# Altium project slam.PrjPCB
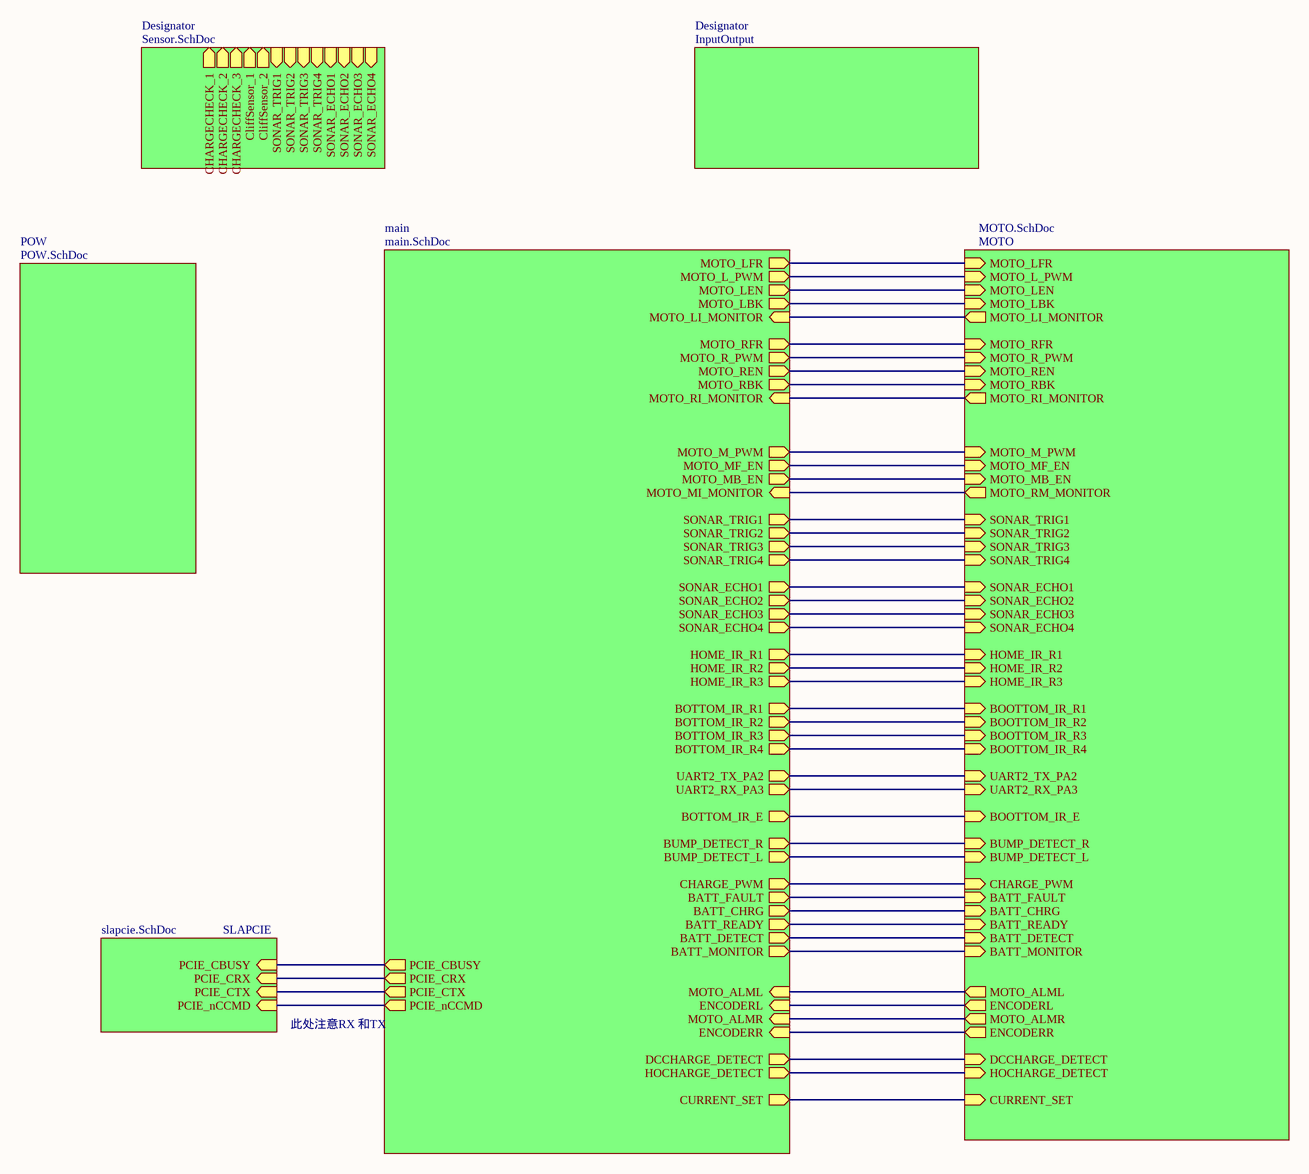
[diagram p0: 框图.SchDoc]
5 sheets, 113 parts. Net scope: hierarchical (ports join the sheet entries above them; power ports are global).
Board file: MAIN.PcbDoc
Sheets:
  框图.SchDoc
    main = main.SchDoc
    SLAPCIE = slapcie.SchDoc
    Designator = Sensor.SchDoc
    Designator = InputOutput.SchDoc

## Sheet 框图.SchDoc
size A3

### Sub-sheets
Designator = Sensor.SchDoc: CHARGECHECK_1 (out), CHARGECHECK_2 (out), CHARGECHECK_3 (out), CliffSensor_1 (out), CliffSensor_2 (out), SONAR_TRIG1 (in), SONAR_TRIG2 (in), SONAR_TRIG3 (in), SONAR_TRIG4 (in), SONAR_ECHO1 (in), SONAR_ECHO2 (in), SONAR_ECHO3 (in), SONAR_ECHO4 (in)
Designator = InputOutput: no entries
main = main.SchDoc: CHARGE_PWM (out), UART2_TX_PA2 (out), UART2_RX_PA3 (out), BOTTOM_IR_R4 (out), BATT_DETECT (out), PCIE_CBUSY (out), BUMP_DETECT_L (out), HOCHARGE_DETECT (out), DCCHARGE_DETECT (out), BUMP_DETECT_R (out), CURRENT_SET (out), BOTTOM_IR_R2 (out), BOTTOM_IR_R1 (out), BATT_MONITOR (out), BOTTOM_IR_R3 (out), MOTO_RI_MONITOR (in), BOTTOM_IR_E (out), PCIE_nCCMD (out), MOTO_MB_EN (out), MOTO_M_PWM (out), MOTO_MF_EN (out), MOTO_LEN (out), MOTO_REN (out), MOTO_RBK (out), MOTO_LBK (out), HOME_IR_R1 (out), HOME_IR_R2 (out), HOME_IR_R3 (out), BATT_READY (out), BATT_CHRG (out), BATT_FAULT (out), SONAR_ECHO1 (out), SONAR_ECHO2 (out), SONAR_ECHO3 (out), SONAR_ECHO4 (out), SONAR_TRIG1 (out), SONAR_TRIG2 (out), SONAR_TRIG3 (out), MOTO_R_PWM (out), MOTO_L_PWM (out), SONAR_TRIG4 (out), PCIE_CRX (out), PCIE_CTX (out), MOTO_MI_MONITOR (in), MOTO_LI_MONITOR (in), MOTO_ALML (in), ENCODERL (in), MOTO_ALMR (in), ENCODERR (in), MOTO_LFR (out), MOTO_RFR (out)
MOTO = MOTO.SchDoc (file not in this document): MOTO_L_PWM (in), MOTO_LEN (in), MOTO_LBK (in), MOTO_R_PWM (in), MOTO_REN (in), MOTO_RBK (in), MOTO_MF_EN (in), MOTO_MB_EN (in), MOTO_LI_MONITOR (out), MOTO_RI_MONITOR (out), MOTO_RM_MONITOR (out), MOTO_ALML (out), ENCODERL (out), MOTO_ALMR (out), ENCODERR (out), SONAR_TRIG1 (in), SONAR_TRIG2 (in), SONAR_TRIG3 (in), SONAR_TRIG4 (in), SONAR_ECHO1 (in), SONAR_ECHO2 (in), SONAR_ECHO3 (in), SONAR_ECHO4 (in), HOME_IR_R1 (in), HOME_IR_R2 (in), HOME_IR_R3 (in), BOOTTOM_IR_R1 (in), BOOTTOM_IR_R2 (in), BOOTTOM_IR_R3 (in), BOOTTOM_IR_R4 (in), BOOTTOM_IR_E (in), BUMP_DETECT_R (in), BUMP_DETECT_L (in), UART2_TX_PA2 (in), UART2_RX_PA3 (in), CHARGE_PWM (in), BATT_FAULT (in), BATT_CHRG (in), BATT_READY (in), BATT_DETECT (in), DCCHARGE_DETECT (in), HOCHARGE_DETECT (in), BATT_MONITOR (in), CURRENT_SET (in), MOTO_M_PWM (in), MOTO_LFR (in), MOTO_RFR (in)
POW = POW.SchDoc (file not in this document): no entries
SLAPCIE = slapcie.SchDoc: PCIE_CBUSY (in), PCIE_CRX (in), PCIE_CTX (in), PCIE_nCCMD (in)

### Nets
CBUSY: sheet main/PCIE_CBUSY, sheet SLAPCIE/PCIE_CBUSY
CRX: sheet main/PCIE_CRX, sheet SLAPCIE/PCIE_CRX
CTX: sheet main/PCIE_CTX, sheet SLAPCIE/PCIE_CTX
nCCMD: sheet main/PCIE_nCCMD, sheet SLAPCIE/PCIE_nCCMD
NetU?#2_1: sheet main/BATT_READY, sheet MOTO/BATT_READY
NetU?#2_2: sheet main/BATT_CHRG, sheet MOTO/BATT_CHRG
NetU?#2_3: sheet main/BATT_FAULT, sheet MOTO/BATT_FAULT
NetU?#2_4: sheet main/SONAR_ECHO1, sheet MOTO/SONAR_ECHO1
NetU?#2_15: sheet main/MOTO_MI_MONITOR, sheet MOTO/MOTO_RM_MONITOR
NetU?#2_16: sheet main/BOTTOM_IR_R2, sheet MOTO/BOOTTOM_IR_R2
NetU?#2_17: sheet main/BOTTOM_IR_R1, sheet MOTO/BOOTTOM_IR_R1
NetU?#2_18: sheet main/BATT_MONITOR, sheet MOTO/BATT_MONITOR
NetU?#2_23: sheet main/CHARGE_PWM, sheet MOTO/CHARGE_PWM
NetU?#2_25: sheet main/UART2_TX_PA2, sheet MOTO/UART2_TX_PA2
NetU?#2_26: sheet main/UART2_RX_PA3, sheet MOTO/UART2_RX_PA3
NetU?#2_29: sheet main/BOTTOM_IR_R4, sheet MOTO/BOOTTOM_IR_R4
NetU?#2_31: sheet main/BATT_DETECT, sheet MOTO/BATT_DETECT
NetU?#2_33: sheet main/MOTO_LI_MONITOR, sheet MOTO/MOTO_LI_MONITOR
NetU?#2_34: sheet main/MOTO_RI_MONITOR, sheet MOTO/MOTO_RI_MONITOR
NetU?#2_38: sheet main/SONAR_ECHO2, sheet MOTO/SONAR_ECHO2
NetU?#2_39: sheet main/SONAR_ECHO3, sheet MOTO/SONAR_ECHO3
NetU?#2_40: sheet main/SONAR_ECHO4, sheet MOTO/SONAR_ECHO4
NetU?#2_41: sheet main/SONAR_TRIG1, sheet MOTO/SONAR_TRIG1
NetU?#2_42: sheet main/SONAR_TRIG2, sheet MOTO/SONAR_TRIG2
NetU?#2_43: sheet main/SONAR_TRIG3, sheet MOTO/SONAR_TRIG3
NetU?#2_44: sheet main/MOTO_R_PWM, sheet MOTO/MOTO_R_PWM
NetU?#2_45: sheet main/MOTO_L_PWM, sheet MOTO/MOTO_L_PWM
NetU?#2_46: sheet main/SONAR_TRIG4, sheet MOTO/SONAR_TRIG4
NetU?#2_52: sheet main/BUMP_DETECT_R, sheet MOTO/BUMP_DETECT_R
NetU?#2_54: sheet main/CURRENT_SET, sheet MOTO/CURRENT_SET
NetU?#2_55: sheet main/MOTO_REN, sheet MOTO/MOTO_REN
NetU?#2_56: sheet main/MOTO_LBK, sheet MOTO/MOTO_LBK
NetU?#2_57: sheet main/MOTO_LEN, sheet MOTO/MOTO_LEN
NetU?#2_58: sheet main/BOTTOM_IR_E, sheet MOTO/BOOTTOM_IR_E
NetU?#2_59: sheet main/HOME_IR_R1, sheet MOTO/HOME_IR_R1
NetU?#2_60: sheet main/HOME_IR_R2, sheet MOTO/HOME_IR_R2
NetU?#2_61: sheet main/HOME_IR_R3, sheet MOTO/HOME_IR_R3
NetU?#2_62: sheet main/BOTTOM_IR_R3, sheet MOTO/BOOTTOM_IR_R3
NetU?#2_63: sheet main/MOTO_ALML, sheet MOTO/MOTO_ALML
NetU?#2_64: sheet main/ENCODERL, sheet MOTO/ENCODERL
NetU?#2_65: sheet main/MOTO_ALMR, sheet MOTO/MOTO_ALMR
NetU?#2_66: sheet main/ENCODERR, sheet MOTO/ENCODERR
NetU?#2_82: sheet main/MOTO_MB_EN, sheet MOTO/MOTO_MB_EN
NetU?#2_83: sheet main/MOTO_M_PWM, sheet MOTO/MOTO_M_PWM
NetU?#2_84: sheet main/MOTO_MF_EN, sheet MOTO/MOTO_MF_EN
NetU?#2_85: sheet main/MOTO_LFR, sheet MOTO/MOTO_LFR
NetU?#2_87: sheet main/MOTO_RFR, sheet MOTO/MOTO_RFR
NetU?#2_88: sheet main/MOTO_RBK, sheet MOTO/MOTO_RBK
NetU?#2_91: sheet main/BUMP_DETECT_L, sheet MOTO/BUMP_DETECT_L
NetU?#2_95: sheet main/HOCHARGE_DETECT, sheet MOTO/HOCHARGE_DETECT
NetU?#2_96: sheet main/DCCHARGE_DETECT, sheet MOTO/DCCHARGE_DETECT

### Notes on the sheet
- 此处注意RX 和TX

## Sheet main.SchDoc
size A3
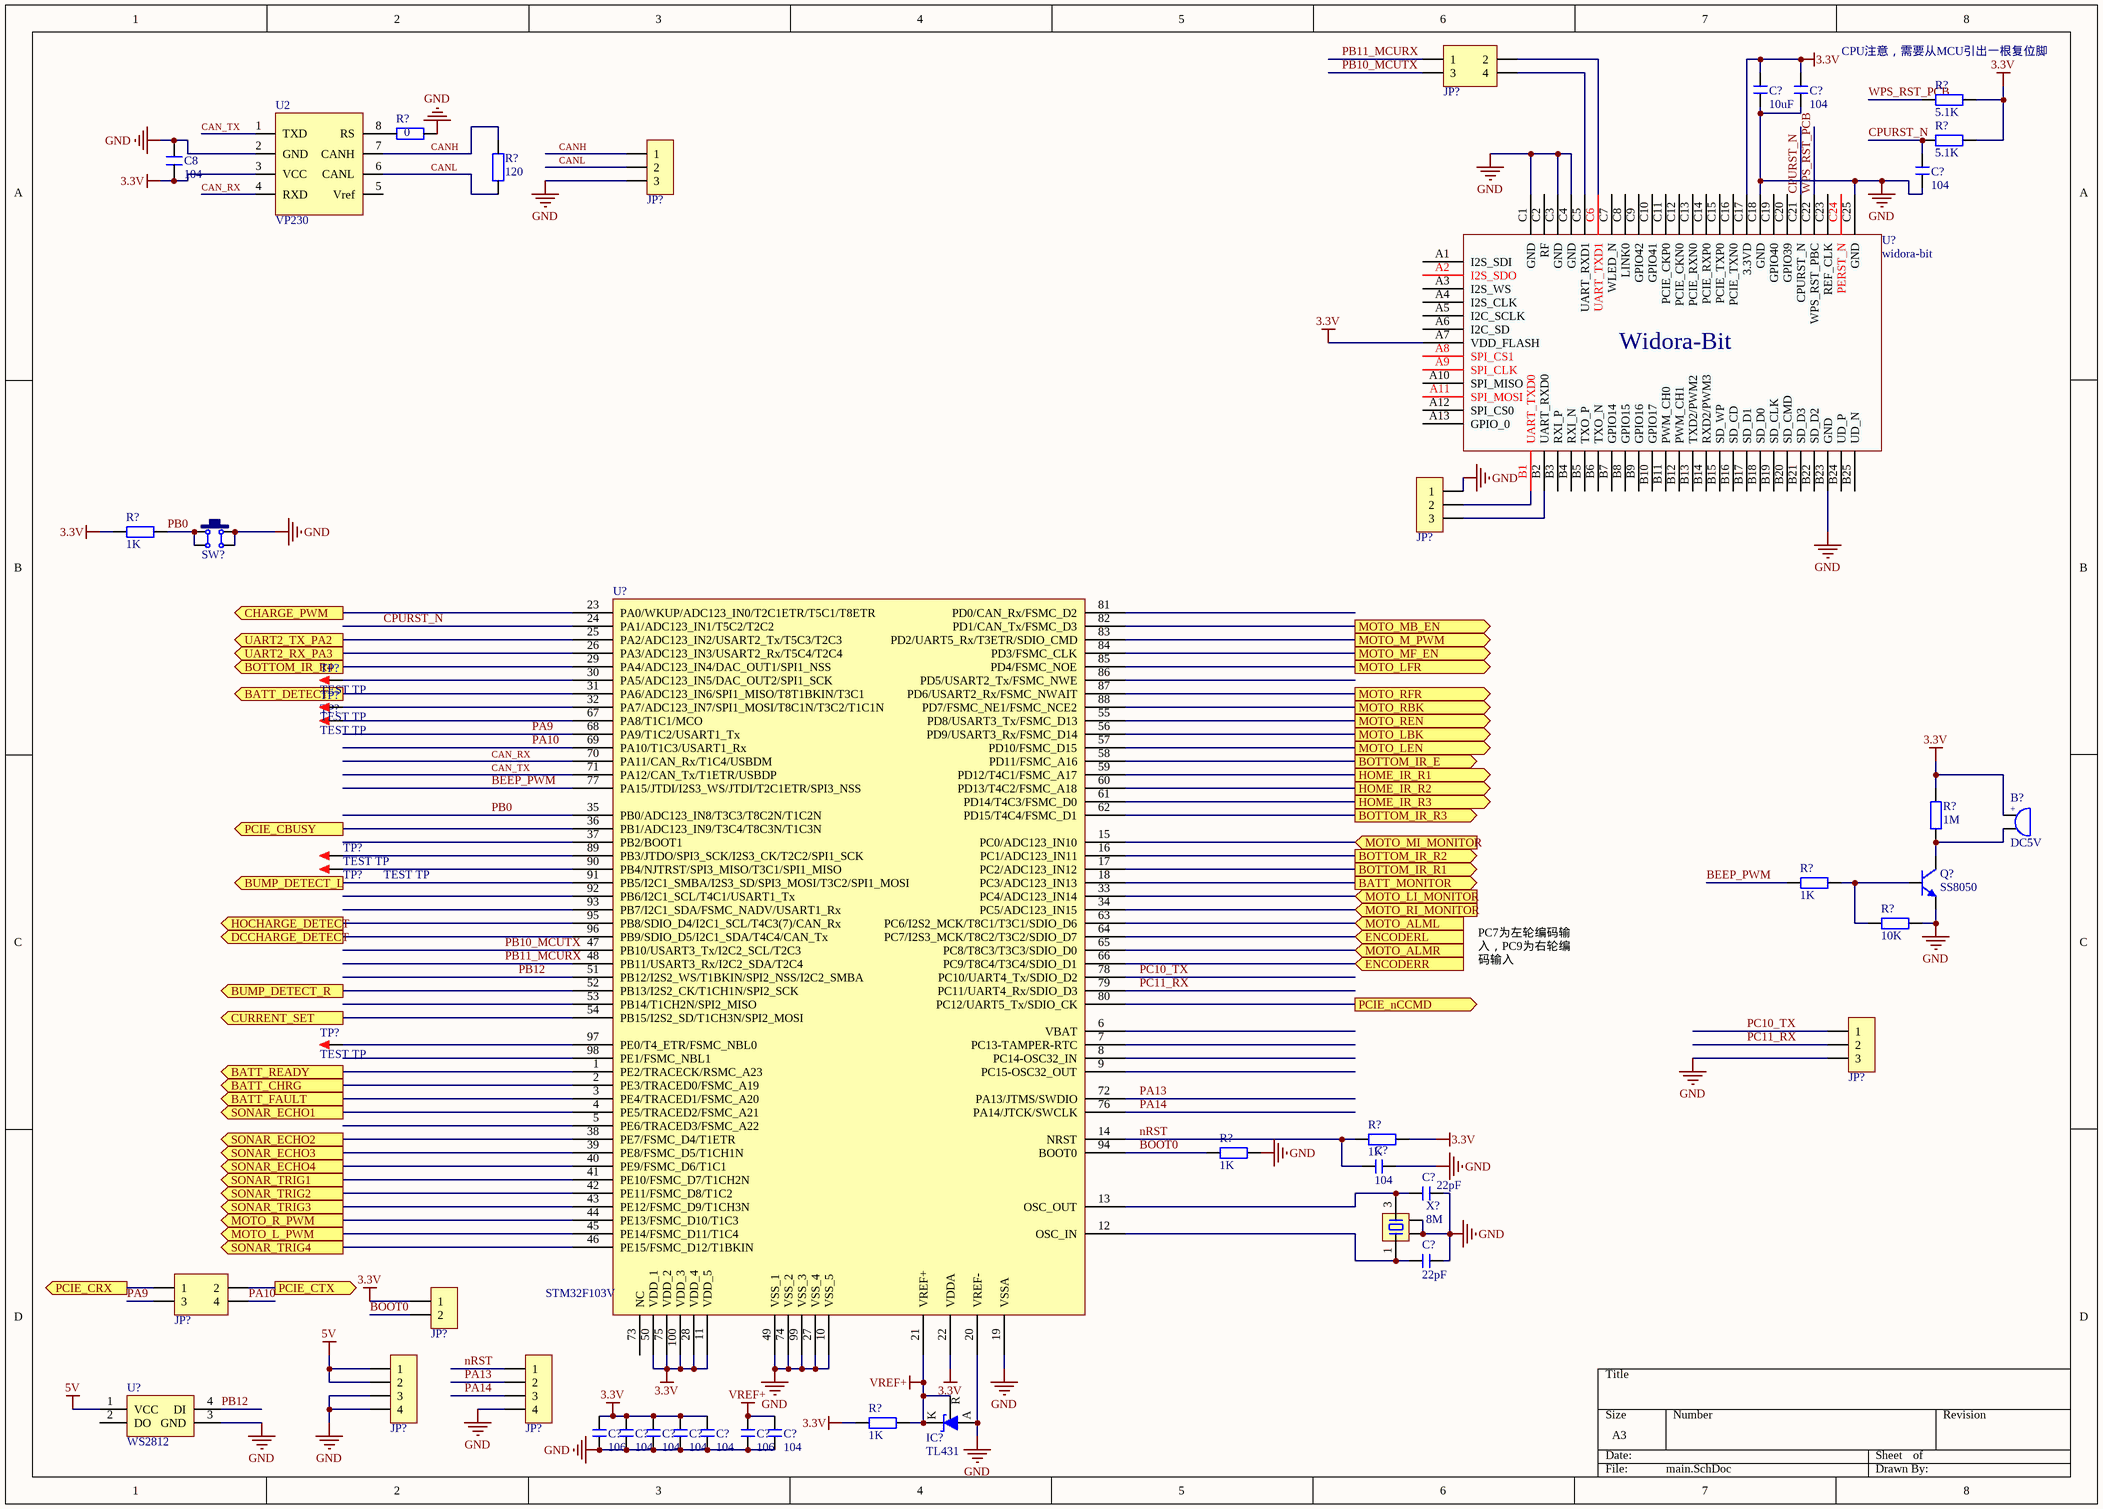
[diagram p1: main.SchDoc]

### Parts
(Parts that share a designator on the sheet are numbered #1, #2 ... from top to bottom, then left to right.)
B?  DC5V  [BEEP 6.5x12x8.5]
C8  104  [C 0603_L]
C?#1  10uF  [C 0805_L]
C?#2  104  [C 0603_L]
C?#3  104  [C 0603_L]
C?#4  104  [C 0603_L]
C?#5  22pF  [C 0603_L]
C?#6  22pF  [C 0603_L]
C?#7  106  [C 0603_L]
C?#8  104  [C 0603_L]
C?#9  104  [C 0603_L]
C?#10  104  [C 0603_L]
C?#11  104  [C 0603_L]
C?#12  106  [C 0603_L]
C?#13  104  [C 0603_L]
IC?  TL431  [SOT23-3N]
JP?#1  Header2X2  [HDR2.54-LI-2x2P]  (value not drawn)
JP?#2  HDR-1X3  [XH2.54-LI-3P]  (value not drawn)
JP?#3  HDR-1X3  [XH2.54-LI-3P]  (value not drawn)
JP?#4  HDR-1X3  [XH2.54-LI-3P]  (value not drawn)
JP?#5  Header2X2  [HDR2.54-LI-2x2P]  (value not drawn)
JP?#6  HDR-1X2  [HDR2.54-LI-2P]  (value not drawn)
JP?#7  HDR-1X4  [HDR-1X4]  (value not drawn)
JP?#8  HDR-1X4  [XH2.54-LI-4P]  (value not drawn)
Q?#1  SS8050  [SOT23-3N]
R?#1  5.1K  [R 0603_L]
R?#2  0  [R 0603_L]
R?#3  5.1K  [R 0603_L]
R?#4  120  [R 0603_L]
R?#5  1K  [R 0603_L]
R?#6  1M  [R 0603_L]
R?#7  1K  [R 0603_L]
R?#8  10K  [R 0603_L]
R?#9  1K  [R 0603_L]
R?#10  1K  [R 0603_L]
R?#11  1K  [R 0603_L]
SW?  6x6x5  [TSW DIP-6*6*6]  (value not drawn)
TP?#1  TEST TP  [TEST TP1.4_BK]
TP?#2  TEST TP  [TEST TP1.4_BK]
TP?#3  TEST TP  [TEST TP1.4_BK]
TP?#4  TEST TP  [TEST TP1.4_BK]
TP?#5  TEST TP  [TEST TP1.4_BK]
TP?#6  TEST TP  [TEST TP1.4_BK]
U2  VP230  [SOP8_N]
U?#1  widora-bit  [Widora-BIT2]
U?#2  STM32F103V  [LQFP100 14X14_N]
U?#3  WS2812  [WS2812]
X?  8M  [OSC 3225-4P]

### Ports
BATT_CHRG (out), BATT_DETECT (out), BATT_FAULT (out), BATT_MONITOR (out), BATT_READY (out), BOTTOM_IR_E (out), BOTTOM_IR_R1 (out), BOTTOM_IR_R2 (out), BOTTOM_IR_R3 (out), BOTTOM_IR_R4 (out), BUMP_DETECT_L (out), BUMP_DETECT_R (out), CHARGE_PWM (out), CURRENT_SET (out), DCCHARGE_DETECT (out), ENCODERL (in), ENCODERR (in), HOCHARGE_DETECT (out), HOME_IR_R1 (out), HOME_IR_R2 (out), HOME_IR_R3 (out), MOTO_ALML (in), MOTO_ALMR (in), MOTO_L_PWM (out), MOTO_LBK (out), MOTO_LEN (out), MOTO_LFR (out), MOTO_LI_MONITOR (in), MOTO_M_PWM (out), MOTO_MB_EN (out), MOTO_MF_EN (out), MOTO_MI_MONITOR (in), MOTO_R_PWM (out), MOTO_RBK (out), MOTO_REN (out), MOTO_RFR (out), MOTO_RI_MONITOR (in), PCIE_CBUSY (out), PCIE_CRX (out), PCIE_CTX (out), PCIE_nCCMD (out), SONAR_ECHO1 (out), SONAR_ECHO2 (out), SONAR_ECHO3 (out), SONAR_ECHO4 (out), SONAR_TRIG1 (out), SONAR_TRIG2 (out), SONAR_TRIG3 (out), SONAR_TRIG4 (out), UART2_RX_PA3 (out), UART2_TX_PA2 (out)

### Nets
3.3V: B?.1 C8.1 C?#1.2 C?#2.2 C?#7.2 C?#8.2 C?#9.2 C?#10.2 C?#11.2 JP?#6.1 R?#1.1 R?#3.1 R?#5.2 R?#6.2 R?#9.1 R?#11.2 U2.3(VCC) U?#1.A7(VDD_FLASH) U?#1.C17(3.3VD) U?#2.11(VDD_5) U?#2.22(VDDA) U?#2.28(VDD_4) U?#2.50(VDD_1) U?#2.75(VDD_2) U?#2.100(VDD_3)
5V: JP?#7.1 JP?#7.2 U?#3.1(VCC)
GND: C8.2 C?#1.1 C?#2.1 C?#3.1 C?#4.1 C?#5.1 C?#6.1 C?#7.1 C?#8.1 C?#9.1 C?#10.1 C?#11.1 C?#12.1 C?#13.1 IC?.3(A) JP?#2.3 JP?#3.1 JP?#4.3 JP?#7.3 JP?#7.4 JP?#8.4 Q?#1.2(E) R?#2.2 R?#8.1 R?#10.1 SW?.2 SW?.3 U2.2(GND) U?#1.B23(GND) U?#1.C1(GND) U?#1.C3(GND) U?#1.C4(GND) U?#1.C18(GND) U?#1.C25(GND) U?#2.10(VSS_5) U?#2.19(VSSA) U?#2.20(VREF-) U?#2.27(VSS_4) U?#2.49(VSS_1) U?#2.74(VSS_2) U?#2.99(VSS_3) U?#3.3(GND) X?.2 X?.4
VREF+: C?#12.2 C?#13.2 IC?.1(R) IC?.2(K) R?#11.1 U?#2.21(VREF+)
BEEP_PWM: R?#7.2 U?#2.77(PA15/JTDI/I2S3_WS/JTDI/T2C1ETR/SPI3_NSS)
BOOT0: JP?#6.2 R?#10.2 U?#2.94(BOOT0)
CAN_RX: U2.4(RXD) U?#2.70(PA11/CAN_Rx/T1C4/USBDM)
CAN_TX: U2.1(TXD) U?#2.71(PA12/CAN_Tx/T1ETR/USBDP)
CANH: JP?#2.1 R?#4.2 U2.7(CANH)
CANL: JP?#2.2 R?#4.1 U2.6(CANL)
CBUSY: U?#2.36(PB1/ADC123_IN9/T3C4/T8C3N/T1C3N) ; port PCIE_CBUSY
CPURST_N: C?#3.2 R?#3.2 U?#1.C21(CPURST_N) U?#2.24(PA1/ADC123_IN1/T5C2/T2C2)
CRX: JP?#5.1 ; port PCIE_CRX
CTX: JP?#5.2 ; port PCIE_CTX
nCCMD: U?#2.80(PC12/UART5_Tx/SDIO_CK) ; port PCIE_nCCMD
nRST: C?#4.2 JP?#8.1 R?#9.2 U?#2.14(NRST)
PA9: JP?#5.3 U?#2.68(PA9/T1C2/USART1_Tx)
PA10: JP?#5.4 U?#2.69(PA10/T1C3/USART1_Rx)
PA13: JP?#8.2 U?#2.72(PA13/JTMS/SWDIO)
PA14: JP?#8.3 U?#2.76(PA14/JTCK/SWCLK)
PB0: R?#5.1 SW?.1 SW?.4 U?#2.35(PB0/ADC123_IN8/T3C3/T8C2N/T1C2N)
PB10_MCUTX: JP?#1.3 U?#2.47(PB10/USART3_Tx/I2C2_SCL/T2C3)
PB11_MCURX: JP?#1.1 U?#2.48(PB11/USART3_Rx/I2C2_SDA/T2C4)
PB12: U?#2.51(PB12/I2S2_WS/T1BKIN/SPI2_NSS/I2C2_SMBA) U?#3.4(DI)
PC10_TX: JP?#4.1 U?#2.78(PC10/UART4_Tx/SDIO_D2)
PC11_RX: JP?#4.2 U?#2.79(PC11/UART4_Rx/SDIO_D3)
WPS_RST_PCB: R?#1.2 U?#1.C22(WPS_RST_PBC)
NetB?_2: B?.2 Q?#1.3(C) R?#6.1
NetC?#5_2: C?#5.2 U?#2.13(OSC_OUT) X?.3
NetC?#6_2: C?#6.2 U?#2.12(OSC_IN) X?.1
NetJP?#1_2: JP?#1.2 U?#1.C6(UART_TXD1)
NetJP?#1_4: JP?#1.4 U?#1.C5(UART_RXD1)
NetJP?#3_2: JP?#3.2 U?#1.B1(UART_TXD0)
NetJP?#3_3: JP?#3.3 U?#1.B2(UART_RXD0)
NetQ?#1_1: Q?#1.1(B) R?#7.1 R?#8.2
NetR?#2_1: R?#2.1 U2.8(RS)
NetTP?#1_1: TP?#1.1 U?#2.30(PA5/ADC123_IN5/DAC_OUT2/SPI1_SCK)
NetTP?#2_1: TP?#2.1 U?#2.32(PA7/ADC123_IN7/SPI1_MOSI/T8C1N/T3C2/T1C1N)
NetTP?#3_1: TP?#3.1 U?#2.67(PA8/T1C1/MCO)
NetTP?#4_1: TP?#4.1 U?#2.89(PB3/JTDO/SPI3_SCK/I2S3_CK/T2C2/SPI1_SCK)
NetTP?#5_1: TP?#5.1 U?#2.90(PB4/NJTRST/SPI3_MISO/T3C1/SPI1_MISO)
NetTP?#6_1: TP?#6.1 U?#2.97(PE0/T4_ETR/FSMC_NBL0)
NetU?#2_1: U?#2.1(PE2/TRACECK/RSMC_A23) ; port BATT_READY
NetU?#2_2: U?#2.2(PE3/TRACED0/FSMC_A19) ; port BATT_CHRG
NetU?#2_3: U?#2.3(PE4/TRACED1/FSMC_A20) ; port BATT_FAULT
NetU?#2_4: U?#2.4(PE5/TRACED2/FSMC_A21) ; port SONAR_ECHO1
NetU?#2_15: U?#2.15(PC0/ADC123_IN10) ; port MOTO_MI_MONITOR
NetU?#2_16: U?#2.16(PC1/ADC123_IN11) ; port BOTTOM_IR_R2
NetU?#2_17: U?#2.17(PC2/ADC123_IN12) ; port BOTTOM_IR_R1
NetU?#2_18: U?#2.18(PC3/ADC123_IN13) ; port BATT_MONITOR
NetU?#2_23: U?#2.23(PA0/WKUP/ADC123_IN0/T2C1ETR/T5C1/T8ETR) ; port CHARGE_PWM
NetU?#2_25: U?#2.25(PA2/ADC123_IN2/USART2_Tx/T5C3/T2C3) ; port UART2_TX_PA2
NetU?#2_26: U?#2.26(PA3/ADC123_IN3/USART2_Rx/T5C4/T2C4) ; port UART2_RX_PA3
NetU?#2_29: U?#2.29(PA4/ADC123_IN4/DAC_OUT1/SPI1_NSS) ; port BOTTOM_IR_R4
NetU?#2_31: U?#2.31(PA6/ADC123_IN6/SPI1_MISO/T8T1BKIN/T3C1) ; port BATT_DETECT
NetU?#2_33: U?#2.33(PC4/ADC123_IN14) ; port MOTO_LI_MONITOR
NetU?#2_34: U?#2.34(PC5/ADC123_IN15) ; port MOTO_RI_MONITOR
NetU?#2_38: U?#2.38(PE7/FSMC_D4/T1ETR) ; port SONAR_ECHO2
NetU?#2_39: U?#2.39(PE8/FSMC_D5/T1CH1N) ; port SONAR_ECHO3
NetU?#2_40: U?#2.40(PE9/FSMC_D6/T1C1) ; port SONAR_ECHO4
NetU?#2_41: U?#2.41(PE10/FSMC_D7/T1CH2N) ; port SONAR_TRIG1
NetU?#2_42: U?#2.42(PE11/FSMC_D8/T1C2) ; port SONAR_TRIG2
NetU?#2_43: U?#2.43(PE12/FSMC_D9/T1CH3N) ; port SONAR_TRIG3
NetU?#2_44: U?#2.44(PE13/FSMC_D10/T1C3) ; port MOTO_R_PWM
NetU?#2_45: U?#2.45(PE14/FSMC_D11/T1C4) ; port MOTO_L_PWM
NetU?#2_46: U?#2.46(PE15/FSMC_D12/T1BKIN) ; port SONAR_TRIG4
NetU?#2_52: U?#2.52(PB13/I2S2_CK/T1CH1N/SPI2_SCK) ; port BUMP_DETECT_R
NetU?#2_54: U?#2.54(PB15/I2S2_SD/T1CH3N/SPI2_MOSI) ; port CURRENT_SET
NetU?#2_55: U?#2.55(PD8/USART3_Tx/FSMC_D13) ; port MOTO_REN
NetU?#2_56: U?#2.56(PD9/USART3_Rx/FSMC_D14) ; port MOTO_LBK
NetU?#2_57: U?#2.57(PD10/FSMC_D15) ; port MOTO_LEN
NetU?#2_58: U?#2.58(PD11/FSMC_A16) ; port BOTTOM_IR_E
NetU?#2_59: U?#2.59(PD12/T4C1/FSMC_A17) ; port HOME_IR_R1
NetU?#2_60: U?#2.60(PD13/T4C2/FSMC_A18) ; port HOME_IR_R2
NetU?#2_61: U?#2.61(PD14/T4C3/FSMC_D0) ; port HOME_IR_R3
NetU?#2_62: U?#2.62(PD15/T4C4/FSMC_D1) ; port BOTTOM_IR_R3
NetU?#2_63: U?#2.63(PC6/I2S2_MCK/T8C1/T3C1/SDIO_D6) ; port MOTO_ALML
NetU?#2_64: U?#2.64(PC7/I2S3_MCK/T8C2/T3C2/SDIO_D7) ; port ENCODERL
NetU?#2_65: U?#2.65(PC8/T8C3/T3C3/SDIO_D0) ; port MOTO_ALMR
NetU?#2_66: U?#2.66(PC9/T8C4/T3C4/SDIO_D1) ; port ENCODERR
NetU?#2_82: U?#2.82(PD1/CAN_Tx/FSMC_D3) ; port MOTO_MB_EN
NetU?#2_83: U?#2.83(PD2/UART5_Rx/T3ETR/SDIO_CMD) ; port MOTO_M_PWM
NetU?#2_84: U?#2.84(PD3/FSMC_CLK) ; port MOTO_MF_EN
NetU?#2_85: U?#2.85(PD4/FSMC_NOE) ; port MOTO_LFR
NetU?#2_87: U?#2.87(PD6/USART2_Rx/FSMC_NWAIT) ; port MOTO_RFR
NetU?#2_88: U?#2.88(PD7/FSMC_NE1/FSMC_NCE2) ; port MOTO_RBK
NetU?#2_91: U?#2.91(PB5/I2C1_SMBA/I2S3_SD/SPI3_MOSI/T3C2/SPI1_MOSI) ; port BUMP_DETECT_L
NetU?#2_95: U?#2.95(PB8/SDIO_D4/I2C1_SCL/T4C3(7)/CAN_Rx) ; port HOCHARGE_DETECT
NetU?#2_96: U?#2.96(PB9/SDIO_D5/I2C1_SDA/T4C4/CAN_Tx) ; port DCCHARGE_DETECT

Not connected (* = marked no-connect by the designer): U2 5(Vref); U?#1 A1(I2S_SDI) A2(I2S_SDO) A3(I2S_WS) A4(I2S_CLK) A5(I2C_SCLK) A6(I2C_SD) A8(SPI_CS1) A9(SPI_CLK) A10(SPI_MISO) A11(SPI_MOSI) A12(SPI_CS0) A13(GPIO_0) B3(RXI_P) B4(RXI_N) B5(TXO_P) B6(TXO_N) B7(GPIO14) B8(GPIO15) B9(GPIO16) B10(GPIO17) B11(PWM_CH0) B12(PWM_CH1) B13(TXD2/PWM2) B14(RXD2/PWM3) B15(SD_WP) B16(SD_CD) B17(SD_D1) B18(SD_D0) B19(SD_CLK) B20(SD_CMD) B21(SD_D3) B22(SD_D2) B24(UD_P) B25(UD_N) C2(RF) C7(WLED_N) C8(LINK0) C9(GPIO42) C10(GPIO41) C11(PCIE_CKP0) C12(PCIE_CKN0) C13(PCIE_RXN0) C14(PCIE_RXP0) C15(PCIE_TXP0) C16(PCIE_TXN0) C19(GPIO40) C20(GPIO39) C23(REF_CLK) C24(PERST_N); U?#2 5(PE6/TRACED3/FSMC_A22) 6(VBAT) 7(PC13-TAMPER-RTC) 8(PC14-OSC32_IN) 9(PC15-OSC32_OUT) 37(PB2/BOOT1) 53(PB14/T1CH2N/SPI2_MISO) 73(NC) 81(PD0/CAN_Rx/FSMC_D2) 86(PD5/USART2_Tx/FSMC_NWE) 92(PB6/I2C1_SCL/T4C1/USART1_Tx) 93(PB7/I2C1_SDA/FSMC_NADV/USART1_Rx) 98(PE1/FSMC_NBL1); U?#3 2(DO)

### Notes on the sheet
- CPU注意，需要从MCU引出一根复位脚
- PC7为左轮编码输入，PC9为右轮编码输入
- (in symbol BEEP) +
- (in symbol widora-bit) Widora-Bit

### Library data of the parts
B? = BEEP: 蜂鸣器; 版权归属: 源创客; BOM名称: 蜂鸣器; 学习资源: www.ooocke.com
C8 = CAP_SMT_0603
C?#1-C?#13 = C: 无极性贴片电容; 版权归属: 源创客; BOM名称: 无极性贴片电容; 学习资源: www.ooocke.com
IC? = TL431_SMD: 可调基准稳压芯片; 版权归属: 源创客; BOM名称: 可调基准稳压芯片; 学习资源: www.ooocke.com
JP?#1 JP?#5 = Header 2X2: 2*2P接插件; 版权归属: 源创客; BOM名称: 2*2P接插件; 学习资源: www.ooocke.com
JP?#2-JP?#4 = Header 3: 3P接插件; 版权归属: 源创客; BOM名称: 3P接插件; 学习资源: www.ooocke.com
JP?#6 = Header 2: 2P接插件; 版权归属: 源创客; BOM名称: 2P接插件; 学习资源: www.ooocke.com
JP?#7 JP?#8 = Header 4: 4P接插件; 版权归属: 源创客; BOM名称: 4P接插件; 学习资源: www.ooocke.com
Q?#1 = 8050-SMD: 高频放大-NPN型; 版权归属: 源创客; 属性: 40V 1.5A 1W 100MHZ; BOM名称: 高频放大-NPN型; 学习资源: www.ooocke.com
R?#1 R?#3 R?#5-R?#11 = R: 贴片电阻; 版权归属: 源创客; BOM名称: 贴片电阻; 学习资源: www.ooocke.com
R?#2 R?#4 = RES_SMT_0603
SW? = TSW DIP-6x6: 直插6x6轻触开关; 版权归属: 源创客; BOM名称: 直插6x6轻触开关; 学习资源: www.ooocke.com
TP?#1-TP?#6 = TEST TP: 测试环; 版权归属: 源创客; BOM名称: 测试环; 学习资源: www.ooocke.com
U?#2 = STM32F103V: 32位STM单片机100引脚; 版权归属: 源创客; BOM名称: 32位STM单片机100引脚; 学习资源: www.ooocke.com
U?#3 = WS2812: 集成LED灯
X? = XTAL-4P: 4脚无源晶振; 版权归属: 源创客; BOM名称: 4脚无源晶振; 学习资源: www.ooocke.com

## Sheet slapcie.SchDoc
size A4
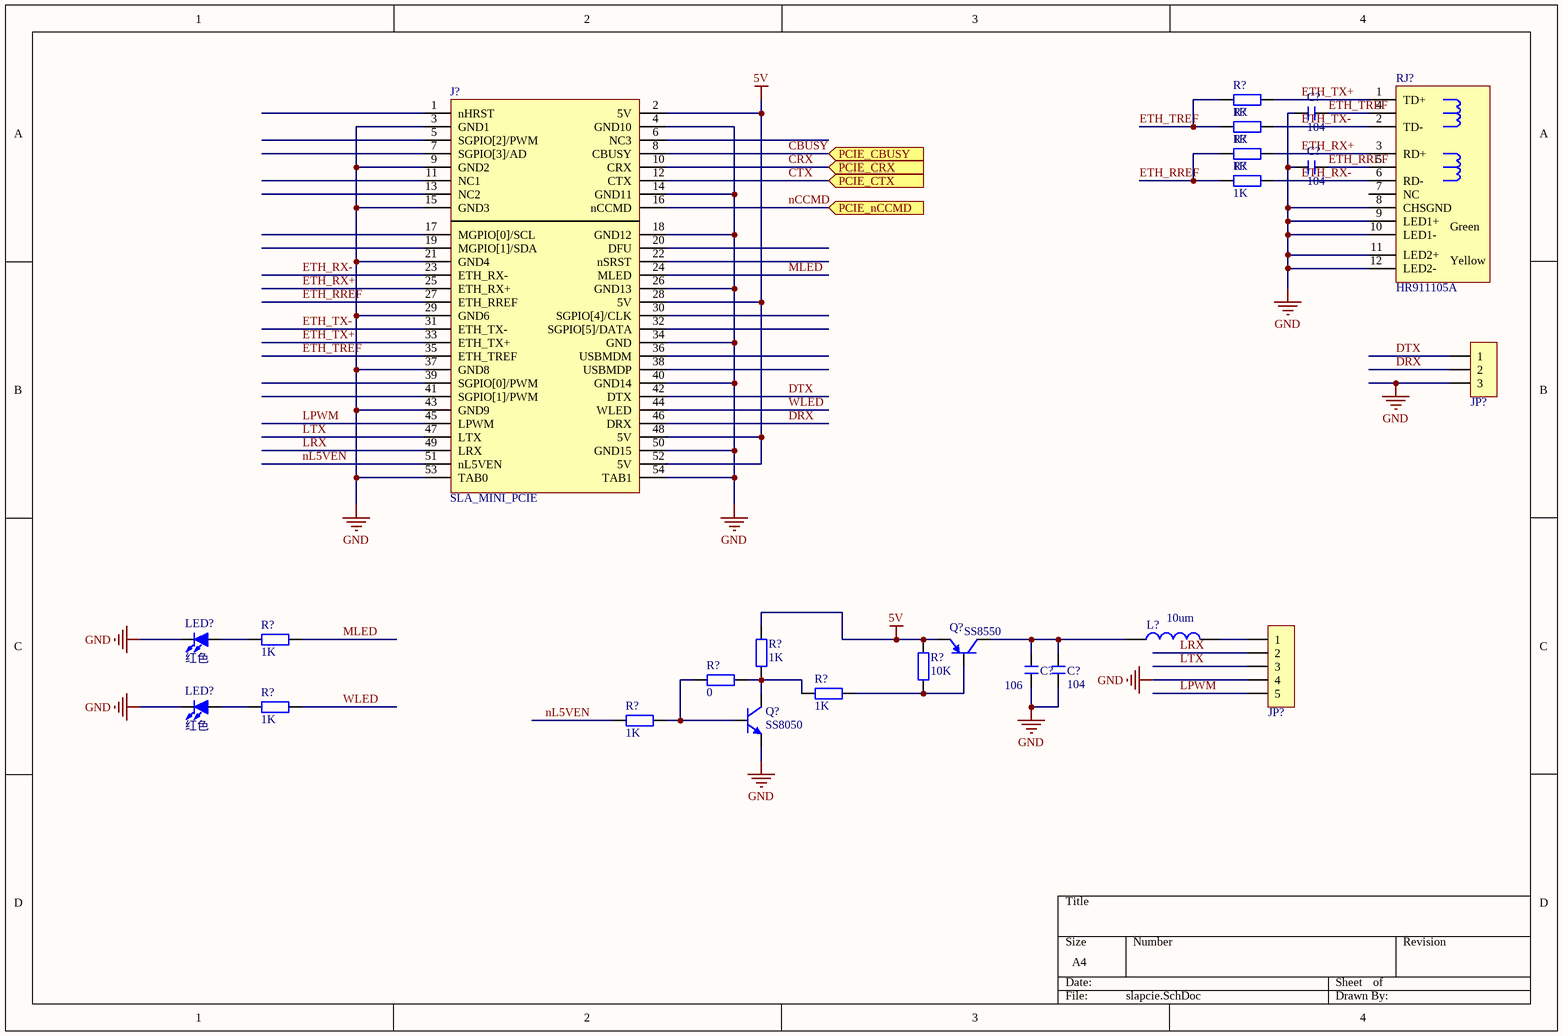
[diagram p2: slapcie.SchDoc]

### Parts
(Parts that share a designator on the sheet are numbered #1, #2 ... from top to bottom, then left to right.)
C?#14  104  [C 0603_L]
C?#15  104  [C 0603_L]
C?#16  104  [C 0603_L]
C?#17  106  [C 0603_L]
J?  SLA_MINI_PCIE  [MINI_PCIE]
JP?#9  HDR-1X3  [XH2.54-LI-3P]  (value not drawn)
JP?#10  HDR-1X5  [XH2.54-WI-5P]  (value not drawn)
L?  10um  [L 0805]
LED?#1  红色  [LED 0603R]
LED?#2  红色  [LED 0603R]
Q?#2  SS8550  [SOT23-3N]
Q?#3  SS8050  [SOT23-3N]
R?#12  1K  [R 0603_L]
R?#13  1K  [R 0603_L]
R?#14  1K  [R 0603_L]
R?#15  1K  [R 0603_L]
R?#16  1K  [R 0603_L]
R?#17  0  [R 0603_L]
R?#18  1K  [R 0603_L]
R?#19  1K  [R 0603_L]
R?#20  10K  [R 0603_L]
R?#21  1K  [R 0603_L]
R?#22  1K  [R 0603_L]
RJ?  HR911105A  [RJ-45A12]

### Ports
PCIE_CBUSY (in), PCIE_CRX (in), PCIE_CTX (in), PCIE_nCCMD (in)

### Nets
5V: J?.2(5V) J?.28(5V) J?.48(5V) J?.52(5V) Q?#2.2(E) R?#18.2 R?#20.2
GND: C?#14.1 C?#15.1 C?#16.2 C?#17.1 J?.3(GND1) J?.4(GND10) J?.9(GND2) J?.14(GND11) J?.15(GND3) J?.18(GND12) J?.21(GND4) J?.26(GND13) J?.29(GND6) J?.34(GND) J?.37(GND8) J?.40(GND14) J?.43(GND9) J?.50(GND15) J?.53(TAB0) J?.54(TAB1) JP?#9.3 JP?#10.4 LED?#1.2(K) LED?#2.2(K) Q?#3.2(E) RJ?.8(CHSGND) RJ?.9(LED1+) RJ?.10(LED1-) RJ?.11(LED2+) RJ?.12(LED2-)
CBUSY: J?.8(CBUSY) ; port PCIE_CBUSY
CRX: J?.10(CRX) ; port PCIE_CRX
CTX: J?.12(CTX) ; port PCIE_CTX
DRX: J?.46(DRX) JP?#9.2
DTX: J?.42(DTX) JP?#9.1
ETH_RREF: C?#15.2 J?.27(ETH_RREF) R?#14.1 R?#15.1 RJ?.5
ETH_RX+: J?.25(ETH_RX+) R?#14.2 RJ?.3(RD+)
ETH_RX-: J?.23(ETH_RX-) R?#15.2 RJ?.6(RD-)
ETH_TREF: C?#14.2 J?.35(ETH_TREF) R?#12.1 R?#13.1 RJ?.4
ETH_TX+: J?.33(ETH_TX+) R?#12.2 RJ?.1(TD+)
ETH_TX-: J?.31(ETH_TX-) R?#13.2 RJ?.2(TD-)
LPWM: J?.45(LPWM) JP?#10.5
LRX: J?.49(LRX) JP?#10.2
LTX: J?.47(LTX) JP?#10.3
MLED: J?.24(MLED) R?#16.2
nCCMD: J?.16(nCCMD) ; port PCIE_nCCMD
nL5VEN: J?.51(nL5VEN) R?#22.1
WLED: J?.44(WLED) R?#21.2
NetC?#16_1: C?#16.1 C?#17.2 L?.1 Q?#2.3(C)
NetJP?#10_1: JP?#10.1 L?.2
NetLED?#1_1: LED?#1.1(A) R?#16.1
NetLED?#2_1: LED?#2.1(A) R?#21.1
NetQ?#2_1: Q?#2.1(B) R?#19.2 R?#20.1
NetQ?#3_1: Q?#3.1(B) R?#17.1 R?#22.2
NetQ?#3_3: Q?#3.3(C) R?#17.2 R?#18.1 R?#19.1

Not connected (* = marked no-connect by the designer): J? 1(nHRST) 5(SGPIO[2]/PWM) 6(NC3) 7(SGPIO[3]/AD) 11(NC1) 13(NC2) 17(MGPIO[0]/SCL) 19(MGPIO[1]/SDA) 20(DFU) 22(nSRST) 30(SGPIO[4]/CLK) 32(SGPIO[5]/DATA) 36(USBMDM) 38(USBMDP) 39(SGPIO[0]/PWM) 41(SGPIO[1]/PWM); RJ? 7(NC)

### Notes on the sheet
- (in symbol HR911105A) Green; Yellow

### Library data of the parts
C?#14-C?#17 = C: 无极性贴片电容; 版权归属: 源创客; BOM名称: 无极性贴片电容; 学习资源: www.ooocke.com
J? = SLA_PCIE
JP?#9 = Header 3: 3P接插件; 版权归属: 源创客; BOM名称: 3P接插件; 学习资源: www.ooocke.com
JP?#10 = Header 5: 5P接插件; 版权归属: 源创客; BOM名称: 5P接插件; 学习资源: www.ooocke.com
L? = L: 小功率贴片电感; 版权归属: 源创客; BOM名称: 小功率贴片电感; 学习资源: www.ooocke.com
LED?#1 LED?#2 = LED-SMD: 贴片LED; 版权归属: 源创客; BOM名称: 贴片LED; 学习资源: www.ooocke.com
Q?#2 = 8550-SMD: 高频放大-PNP型; 版权归属: 源创客; 属性: 40V 1.5A 1W 100MHZ; BOM名称: 高频放大-PNP型; 学习资源: www.ooocke.com
Q?#3 = 8050-SMD: as Q?#1 on sheet main; BOM名称: 高频放大-NPN型; 学习资源: www.ooocke.com
R?#12-R?#22 = R: 贴片电阻; 版权归属: 源创客; BOM名称: 贴片电阻; 学习资源: www.ooocke.com
RJ? = HR911105A: 带灯以太网接口; 版权归属: 源创客; BOM名称: 带灯以太网接口; 学习资源: www.ooocke.com

## Sheet Sensor.SchDoc
size A4
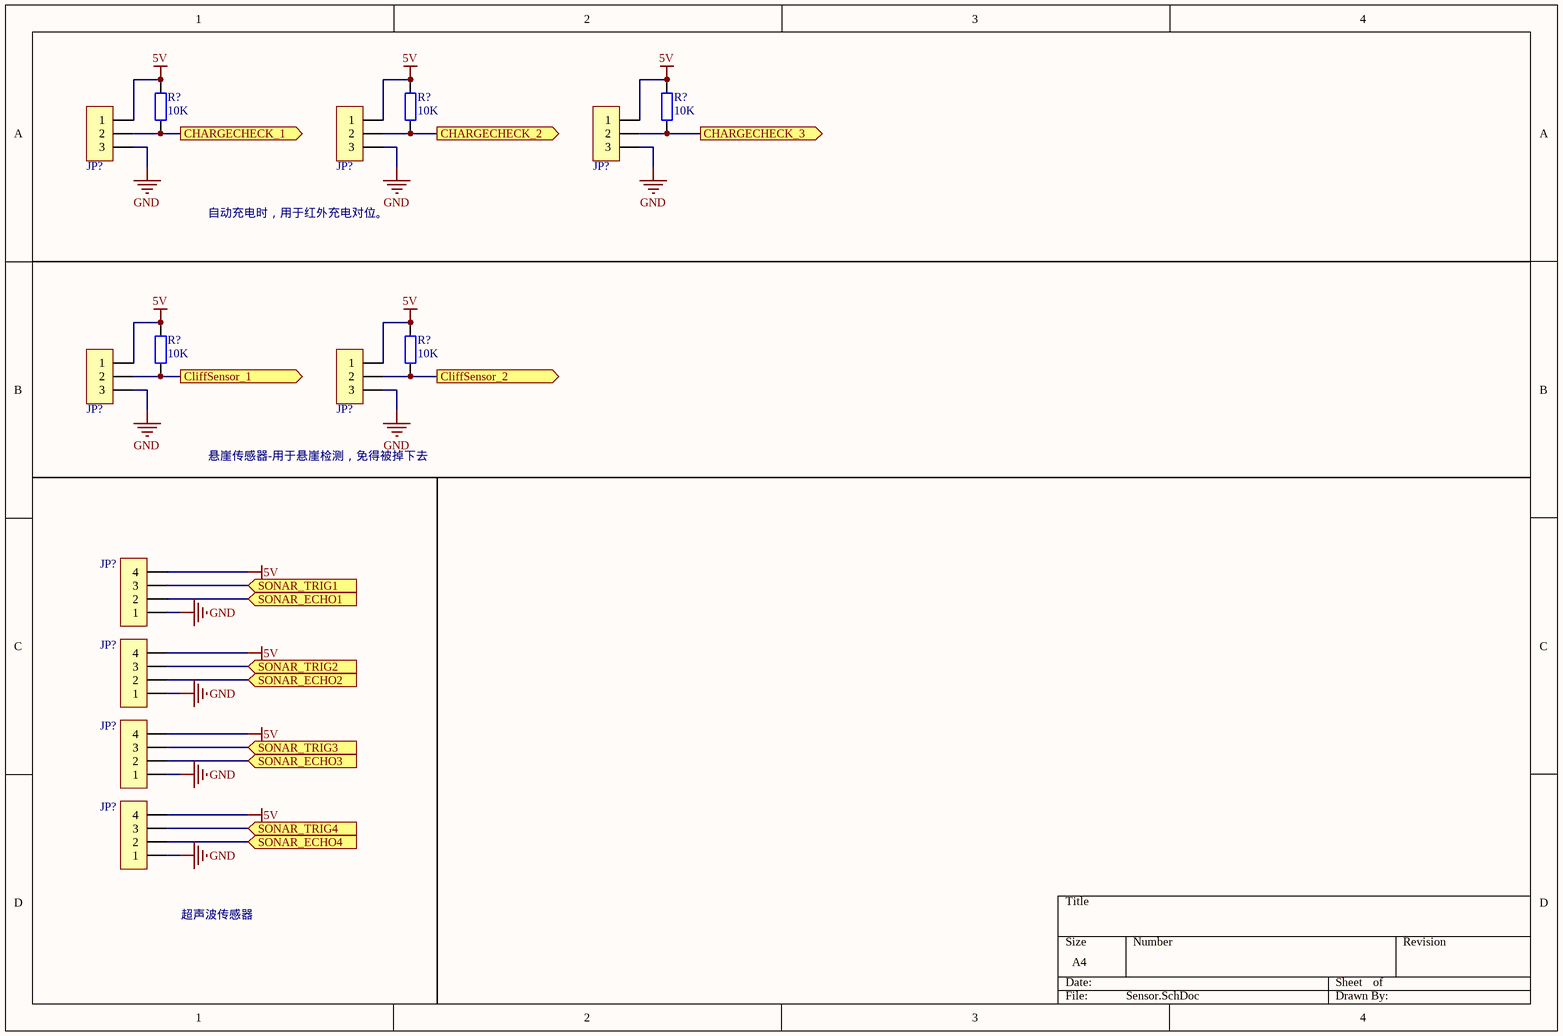
[diagram p3: Sensor.SchDoc]

### Parts
(Parts that share a designator on the sheet are numbered #1, #2 ... from top to bottom, then left to right.)
JP?#11  HDR-1X3  [XH2.54-LI-3P]  (value not drawn)
JP?#12  HDR-1X3  [XH2.54-LI-3P]  (value not drawn)
JP?#13  HDR-1X3  [XH2.54-LI-3P]  (value not drawn)
JP?#14  HDR-1X3  [XH2.54-LI-3P]  (value not drawn)
JP?#15  HDR-1X3  [XH2.54-LI-3P]  (value not drawn)
JP?#16  HDR-1X4  [XH2.54-LI-4P]  (value not drawn)
JP?#17  HDR-1X4  [XH2.54-LI-4P]  (value not drawn)
JP?#18  HDR-1X4  [XH2.54-LI-4P]  (value not drawn)
JP?#19  HDR-1X4  [XH2.54-LI-4P]  (value not drawn)
R?#23  10K  [R 0603_M]
R?#24  10K  [R 0603_M]
R?#25  10K  [R 0603_M]
R?#26  10K  [R 0603_M]
R?#27  10K  [R 0603_M]

### Ports
CHARGECHECK_1 (out), CHARGECHECK_2 (out), CHARGECHECK_3 (out), CliffSensor_1 (out), CliffSensor_2 (out), SONAR_ECHO1 (in), SONAR_ECHO2 (in), SONAR_ECHO3 (in), SONAR_ECHO4 (in), SONAR_TRIG1 (in), SONAR_TRIG2 (in), SONAR_TRIG3 (in), SONAR_TRIG4 (in)

### Nets
5V: JP?#11.1 JP?#12.1 JP?#13.1 JP?#14.1 JP?#15.1 JP?#16.4 JP?#17.4 JP?#18.4 JP?#19.4 R?#23.2 R?#24.2 R?#25.2 R?#26.2 R?#27.2
GND: JP?#11.3 JP?#12.3 JP?#13.3 JP?#14.3 JP?#15.3 JP?#16.1 JP?#17.1 JP?#18.1 JP?#19.1
NetJP?#11_2: JP?#11.2 R?#23.1 ; port CHARGECHECK_1
NetJP?#12_2: JP?#12.2 R?#24.1 ; port CHARGECHECK_2
NetJP?#13_2: JP?#13.2 R?#25.1 ; port CHARGECHECK_3
NetJP?#14_2: JP?#14.2 R?#26.1 ; port CliffSensor_1
NetJP?#15_2: JP?#15.2 R?#27.1 ; port CliffSensor_2
NetJP?#16_2: JP?#16.2 ; port SONAR_ECHO1
NetJP?#16_3: JP?#16.3 ; port SONAR_TRIG1
NetJP?#17_2: JP?#17.2 ; port SONAR_ECHO2
NetJP?#17_3: JP?#17.3 ; port SONAR_TRIG2
NetJP?#18_2: JP?#18.2 ; port SONAR_ECHO3
NetJP?#18_3: JP?#18.3 ; port SONAR_TRIG3
NetJP?#19_2: JP?#19.2 ; port SONAR_ECHO4
NetJP?#19_3: JP?#19.3 ; port SONAR_TRIG4

### Notes on the sheet
- 自动充电时，用于红外充电对位。
- 悬崖传感器-用于悬崖检测，免得被掉下去
- 超声波传感器

### Library data of the parts
JP?#11-JP?#15 = Header 3: 3P接插件; 版权归属: 源创客; BOM名称: 3P接插件; 学习资源: www.ooocke.com
JP?#16-JP?#19 = Header 4: 4P接插件; 版权归属: 源创客; BOM名称: 4P接插件; 学习资源: www.ooocke.com
R?#23-R?#27 = R: 贴片电阻; 版权归属: 源创客; BOM名称: 贴片电阻; 学习资源: www.ooocke.com

## Sheet InputOutput.SchDoc
size A4
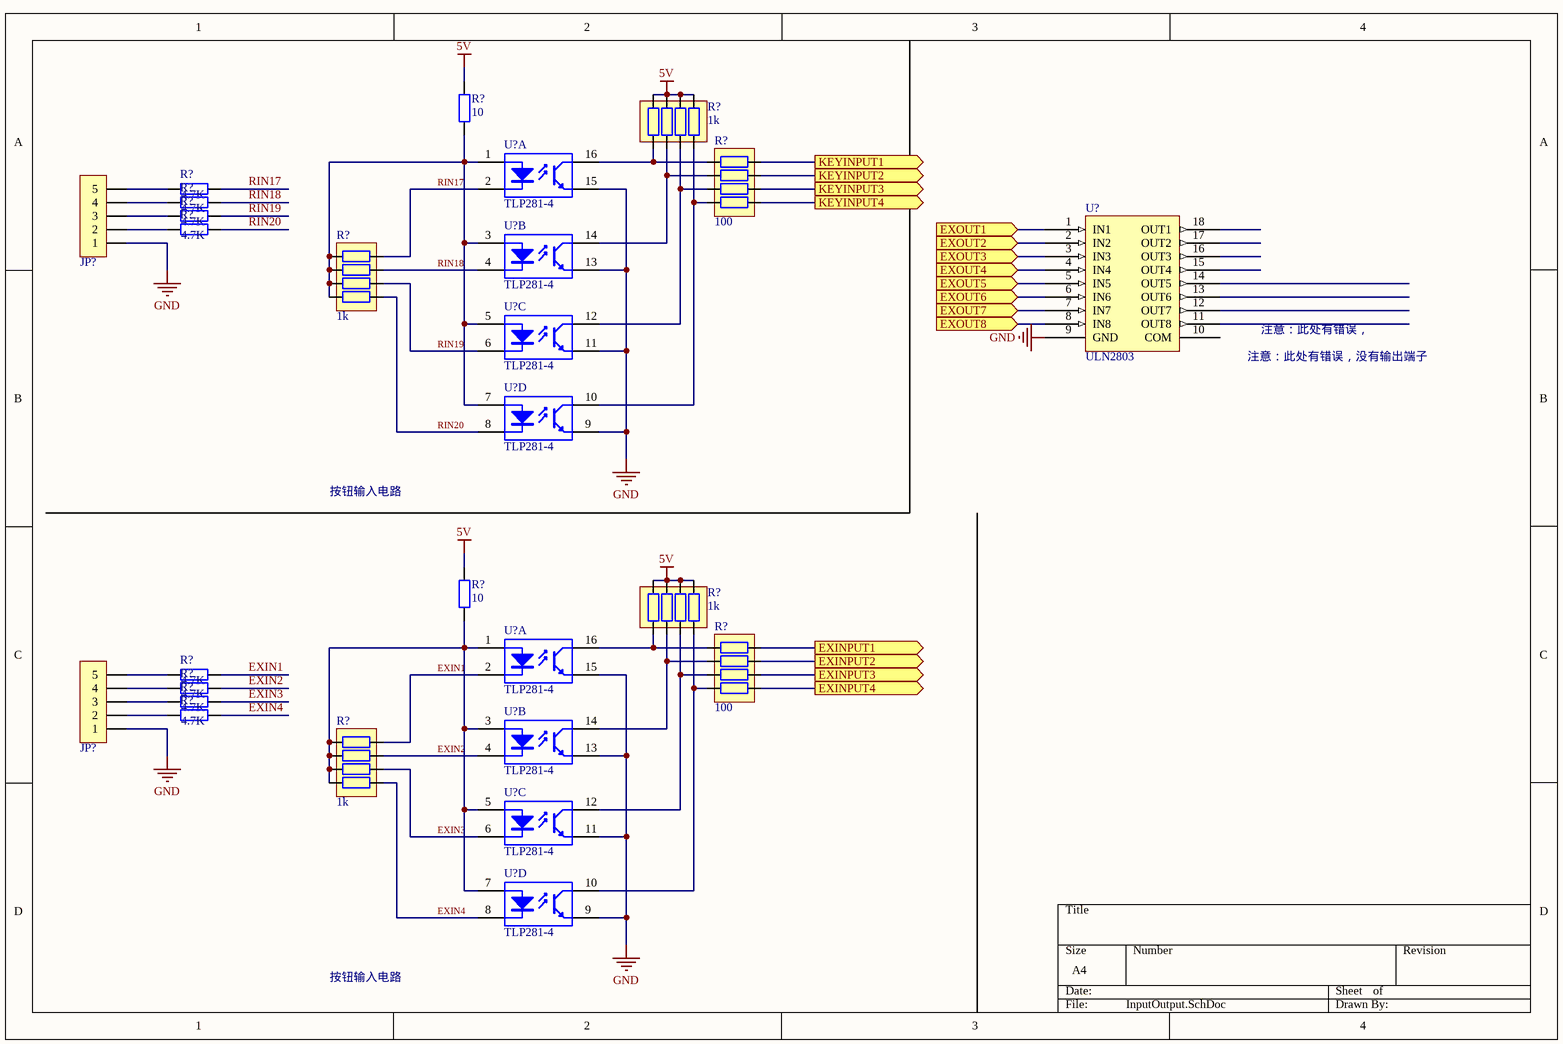
[diagram p4: InputOutput.SchDoc]

### Parts
(Parts that share a designator on the sheet are numbered #1, #2 ... from top to bottom, then left to right.)
JP?#20  HDR-1X5  [XH2.54-LI-5P]  (value not drawn)
JP?#21  HDR-1X5  [XH2.54-LI-5P]  (value not drawn)
R?#28  10  [R 0603_L]
R?#29  1k  [RCA-8P4R-0603]
R?#30  100  [RCA-8P4R-0603]
R?#31  4.7K  [R 0603_L]
R?#32  4.7K  [R 0603_L]
R?#33  4.7K  [R 0603_L]
R?#34  4.7K  [R 0603_L]
R?#35  1k  [RCA-8P4R-0603]
R?#36  10  [R 0603_L]
R?#37  1k  [RCA-8P4R-0603]
R?#38  100  [RCA-8P4R-0603]
R?#39  4.7K  [R 0603_L]
R?#40  4.7K  [R 0603_L]
R?#41  4.7K  [R 0603_L]
R?#42  4.7K  [R 0603_L]
R?#43  1k  [RCA-8P4R-0603]
U?#4  TLP281-4  [SOP16N_N]  (part A of 4)
U?#5  ULN2803  [SO-G18]
U?#6  TLP281-4  [SOP16N_n]  (part B of 4)
U?#7  TLP281-4  [SOP16N_n]  (part C of 4)
U?#8  TLP281-4  [SOP16N_n]  (part D of 4)
U?#9  TLP281-4  [SOP16N_N]  (part A of 4)
U?#10  TLP281-4  [SOP16N_n]  (part B of 4)
U?#11  TLP281-4  [SOP16N_n]  (part C of 4)
U?#12  TLP281-4  [SOP16N_n]  (part D of 4)

### Ports
EXINPUT1 (out), EXINPUT2 (out), EXINPUT3 (out), EXINPUT4 (out), EXOUT1 (in), EXOUT2 (in), EXOUT3 (in), EXOUT4 (in), EXOUT5 (in), EXOUT6 (in), EXOUT7 (in), EXOUT8 (in), KEYINPUT1 (out), KEYINPUT2 (out), KEYINPUT3 (out), KEYINPUT4 (out)

### Nets
5V: R?#28.1 R?#29.5 R?#29.6 R?#29.7 R?#29.8 R?#36.1 R?#37.5 R?#37.6 R?#37.7 R?#37.8
GND: JP?#20.1 JP?#21.1 U?#4.15 U?#5.9(GND) U?#6.13 U?#7.11 U?#8.9 U?#9.15 U?#10.13 U?#11.11 U?#12.9
EXIN1: R?#39.1 R?#43.8 U?#9.2
EXIN2: R?#40.1 R?#43.7 U?#10.4
EXIN3: R?#41.1 R?#43.6 U?#11.6
EXIN4: R?#42.1 R?#43.5 U?#12.8
RIN17: R?#31.1 R?#35.8 U?#4.2
RIN18: R?#32.1 R?#35.7 U?#6.4
RIN19: R?#33.1 R?#35.6 U?#7.6
RIN20: R?#34.1 R?#35.5 U?#8.8
NetJP?#20_2: JP?#20.2 R?#34.2
NetJP?#20_3: JP?#20.3 R?#33.2
NetJP?#20_4: JP?#20.4 R?#32.2
NetJP?#20_5: JP?#20.5 R?#31.2
NetJP?#21_2: JP?#21.2 R?#42.2
NetJP?#21_3: JP?#21.3 R?#41.2
NetJP?#21_4: JP?#21.4 R?#40.2
NetJP?#21_5: JP?#21.5 R?#39.2
NetR?#28_2: R?#28.2 R?#35.1 R?#35.2 R?#35.3 R?#35.4 U?#4.1 U?#6.3 U?#7.5 U?#8.7
NetR?#29_1: R?#29.1 R?#30.8 U?#4.16
NetR?#29_2: R?#29.2 R?#30.7 U?#6.14
NetR?#29_3: R?#29.3 R?#30.6 U?#7.12
NetR?#29_4: R?#29.4 R?#30.5 U?#8.10
NetR?#30_1: R?#30.1 ; port KEYINPUT1
NetR?#30_2: R?#30.2 ; port KEYINPUT2
NetR?#30_3: R?#30.3 ; port KEYINPUT3
NetR?#30_4: R?#30.4 ; port KEYINPUT4
NetR?#36_2: R?#36.2 R?#43.1 R?#43.2 R?#43.3 R?#43.4 U?#9.1 U?#10.3 U?#11.5 U?#12.7
NetR?#37_1: R?#37.1 R?#38.8 U?#9.16
NetR?#37_2: R?#37.2 R?#38.7 U?#10.14
NetR?#37_3: R?#37.3 R?#38.6 U?#11.12
NetR?#37_4: R?#37.4 R?#38.5 U?#12.10
NetR?#38_1: R?#38.1 ; port EXINPUT1
NetR?#38_2: R?#38.2 ; port EXINPUT2
NetR?#38_3: R?#38.3 ; port EXINPUT3
NetR?#38_4: R?#38.4 ; port EXINPUT4
NetU?#5_1: U?#5.1(IN1) ; port EXOUT1
NetU?#5_2: U?#5.2(IN2) ; port EXOUT2
NetU?#5_3: U?#5.3(IN3) ; port EXOUT3
NetU?#5_4: U?#5.4(IN4) ; port EXOUT4
NetU?#5_5: U?#5.5(IN5) ; port EXOUT5
NetU?#5_6: U?#5.6(IN6) ; port EXOUT6
NetU?#5_7: U?#5.7(IN7) ; port EXOUT7
NetU?#5_8: U?#5.8(IN8) ; port EXOUT8

Not connected (* = marked no-connect by the designer): U?#5 10(COM) 11(OUT8) 12(OUT7) 13(OUT6) 14(OUT5) 15(OUT4) 16(OUT3) 17(OUT2) 18(OUT1)

### Notes on the sheet
- 注意：此处有错误，没有输出端子
- 注意：此处有错误，
- 按钮输入电路

### Library data of the parts
JP?#20 JP?#21 = Header 5: 5P接插件; 版权归属: 源创客; BOM名称: 5P接插件; 学习资源: www.ooocke.com
R?#28 R?#31-R?#34 R?#36 R?#39-R?#42 = R: 贴片电阻; 版权归属: 源创客; BOM名称: 贴片电阻; 学习资源: www.ooocke.com
R?#29 R?#30 R?#35 R?#37 R?#38 R?#43 = R-8P4R: 贴片网络排阻; 版权归属: 源创客; BOM名称: 贴片网络排阻; 学习资源: www.ooocke.com

## Nets that join several sheets
5V: main (JP?#7.1 JP?#7.2 U?#3.1), slapcie (7 pins), Sensor (14 pins), InputOutput (10 pins)
GND: main (44 pins), slapcie (30 pins), Sensor (9 pins), InputOutput (11 pins)
CBUSY: main (U?#2.36), slapcie (J?.8)
CRX: main (JP?#5.1), slapcie (J?.10)
CTX: main (JP?#5.2), slapcie (J?.12)
nCCMD: main (U?#2.80), slapcie (J?.16)